# EAGLE design ngc-breakout (EAGLE 7.5.0)
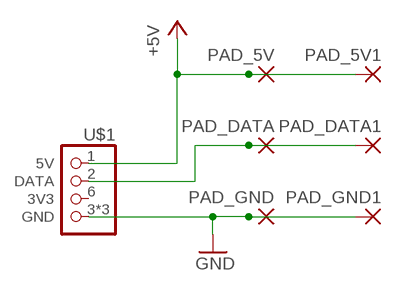
[diagram p0: schematic, sheet 1]

## Parts
PAD_5V  SMD2  [SMD1,27-2,54]
PAD_5V1  SMD2  [SMD1,27-2,54]
PAD_DATA  SMD2  [SMD1,27-2,54]
PAD_DATA1  SMD2  [SMD1,27-2,54]
PAD_GND  SMD2  [SMD1,27-2,54]
PAD_GND1  SMD2  [SMD1,27-2,54]
U$1  NGC-CONNECTORGC-CONN2  [NGC-CONNECTOR]

## Nets
+5V: PAD_5V1.1(P) PAD_5V.1(P) U$1.1(5V)
GND: PAD_GND1.1(P) PAD_GND.1(P) U$1.3(GND) U$1.4(GND) U$1.7(GND)
N$1: PAD_DATA1.1(P) PAD_DATA.1(P) U$1.2(DATA)
Unconnected: U$1.6(3V3)

## Library data of the parts
PAD_5V PAD_5V1 PAD_DATA PAD_DATA1 PAD_GND PAD_GND1 = wirepad:SMD2: SMD PAD
U$1 = munia-breakouts:NGC-CONNECTOR

## Board
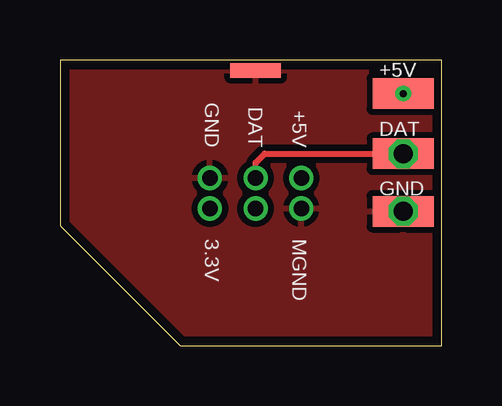
[diagram p1: board, top side]
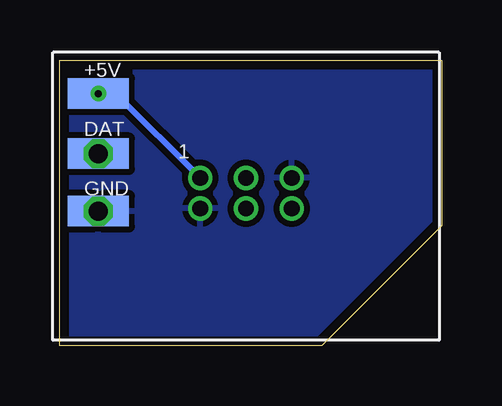
[diagram p2: board, bottom side, seen from below]

Size 15.9 x 11.9 mm. Coordinates in mm from the lower left corner, seen from the top.
Outline: 0,11.9 0,5 5,0 15.9,0 15.9,11.9 0,11.9
Copper layers (1*16): Top 0.0356mm / dielectric 1.5011mm / Bottom 0.0356mm
Design rules "pcbway 6mil 0.3mm drills": minimum track width 6mil, minimum drill 0.25mm, track to track 6mil, track to pad 6mil, pad to pad 6mil, via to via 6mil, smd to smd 6mil, copper to edge 15mil, drill to drill 6mil, minimum pad ring 7mil, minimum via ring 7mil, stop-mask expansion 4mil, vias tented up to drill 999mil, thermal gap 10mil

### Footprints (pad centres in the part's own frame; a part is rotated, then mirrored left to right if it is on the bottom)
SMD1,27-2,54 = smd 1.27 x 2.54: 1 0,0
NGC-CONNECTOR = drill 0.65: 1 -1.905,0.635; 2 0,0.635; 3 1.905,0.635; 4 -1.905,-0.635; 5 0,-0.635; 6 1.905,-0.635 | smd 2.1 x 0.6 bottom: 7 0,5.115

### Placement (x,y rotation side)
PAD_5V  14.3,10.5 90 top
PAD_5V1  14.3,10.5 270 bottom
PAD_DATA  14.3,8 90 top
PAD_DATA1  14.3,8 270 bottom
PAD_GND  14.3,5.59 90 top
PAD_GND1  14.3,5.6 270 bottom
U$1  8.15,6.35 0 bottom

### Tracks (layer width: path | path; a pad name or v marks a point on that pad's centre or on a via)
+5V  (via drill 0.3)
  Top 0.254: 15.2,10.5 15.3,10.5 | PAD_5V1.1 15.2,10.5 | 15.2,10.5 15.2,10.6 15.3,10.5 | 15.3,10.5 15.3,10.4 15.1,10.2 15.1,10
  Bottom 0.254: U$1.1 13.57,10.5 PAD_5V1.1
  other vias: 14.3,10.5
GND
  pour Bottom (isolate 0.254): -0.5,12.7 -0.3,-0.2 16.4,-0.2 16.2,12.7
  pour Top (isolate 0.254): -0.5,12.9 -0.5,-0.4 16.7,-0.4 16.7,12.9
N$1  (via drill 0.8)
  Top 0.254: U$1.2 8.15,7.62 8.53,8 PAD_DATA1.1
  other vias: 14.3,8
N$2  (via drill 0.8)
  other vias: 14.3,5.6

### Text on the board
tPlace: +5V / / / DAT / / / GND
bPlace: +5V / / / DAT / / / GND | 1
tDocu: (c) 2016 MUNIA.io
bDocu: (c) 2016 MUNIA.io